# EasyEDA schematic SCH_EASYEDA.json
TITLE: LTR-PCB-v2.0; REV: 1.0; Date: 2025-11-01; Sheet: 1/1; Drawn By: b38543793; Company: Your Company
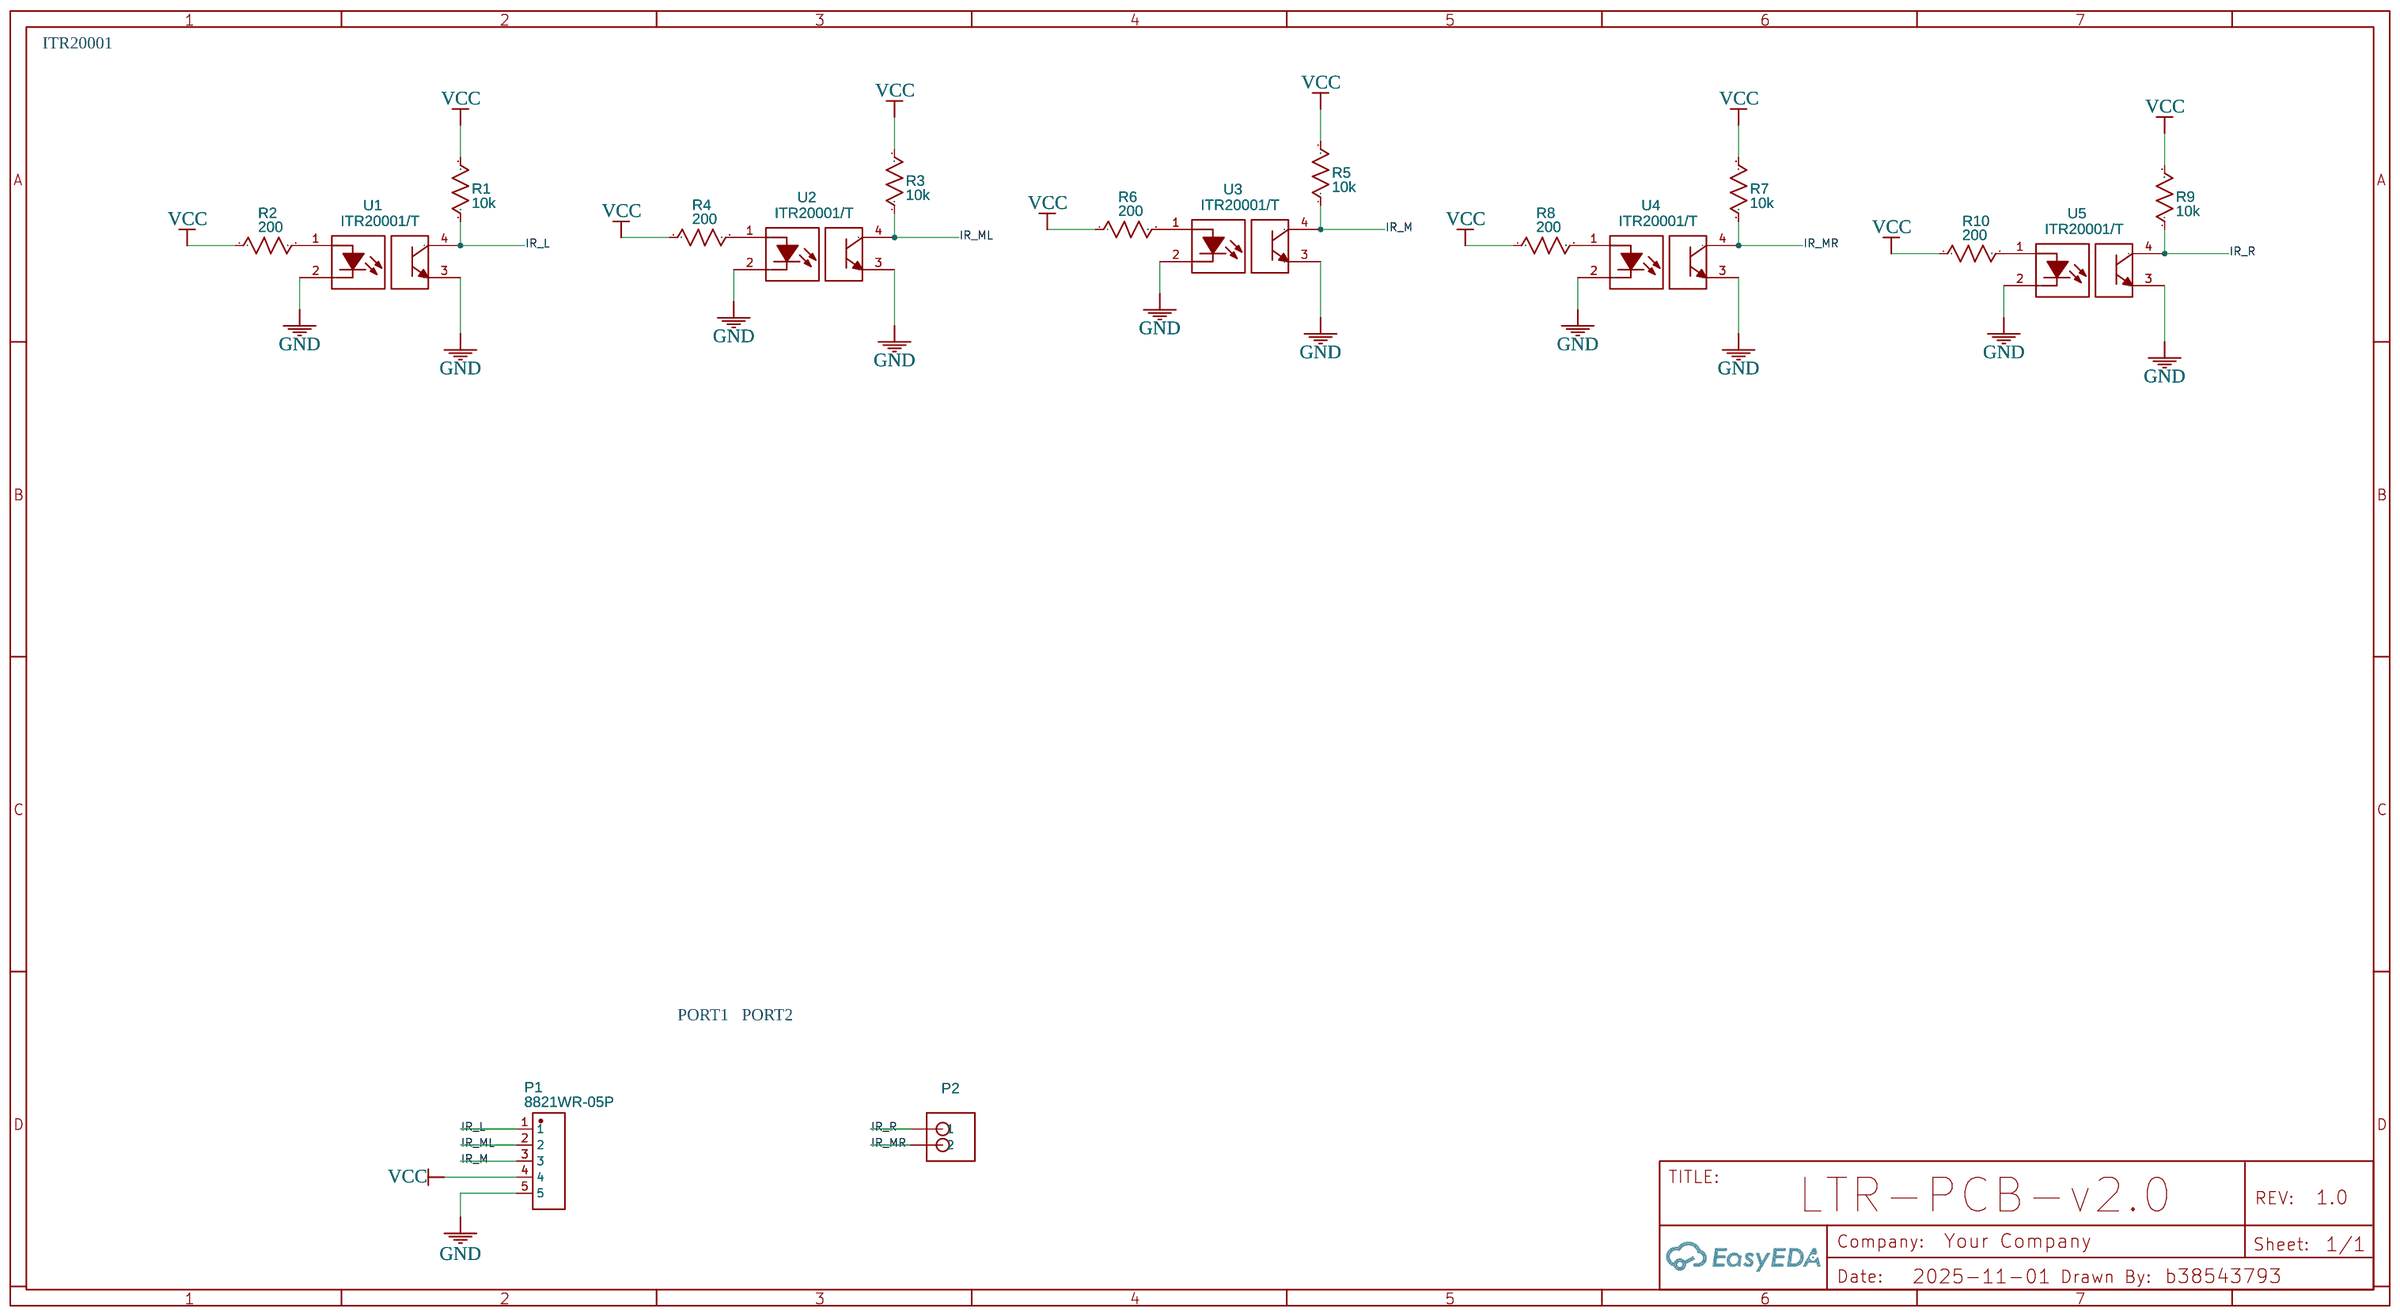
[diagram p0: schematic sheet]

## Parts
P1  8821WR-05P  [CONN-TH_5P-P2.50_HC-XH-5AW-G]
P2  JST-PH_2-PIN_HEADER  [JST_B2B-PH_HEADER]
R1  10k  [R0603]
R2  200  [R0603]
R3  10k  [R0603]
R4  200  [R0603]
R5  10k  [R0603]
R6  200  [R0603]
R7  10k  [R0603]
R8  200  [R0603]
R9  10k  [R0603]
R10  200  [R0603]
U1  ITR20001/T  [OPTO-TH_4P_ITR20001-T-F316]
U2  ITR20001/T  [OPTO-TH_4P_ITR20001-T-F316]
U3  ITR20001/T  [OPTO-TH_4P_ITR20001-T-F316]
U4  ITR20001/T  [OPTO-TH_4P_ITR20001-T-F316]
U5  ITR20001/T  [OPTO-TH_4P_ITR20001-T-F316]

## Library data of the parts
P1 = 8821WR-05P: Supplier: LCSC; Supplier Part: C5447998; Manufacturer: HanElectricity(瀚源); JLCPCB Part Class: Extended Part; Contributor: lcsc
P2 = JST-PH_2-PIN_HEADER
R1-R10 = R_0603_US: Contributor: LCEDA_Lib
U1-U5 = ITR20001/T: Contributor: LCSC; Supplier: LCSC; Supplier Part: C264269; Manufacturer: EVERLIGHT(亿光); JLCPCB Part Class: Extended Part

## Nets
GND: P1.5 U1.2 U1.3 U2.2 U2.3 U3.2 U3.3 U4.2 U4.3 U5.2 U5.3
VCC: P1.4 R1.2 R2.1 R3.2 R4.1 R5.2 R6.1 R7.2 R8.1 R9.2 R10.1
IR_L: P1.1 R1.1 U1.4
IR_M: P1.3 R5.1 U3.4
IR_ML: P1.2 R3.1 U2.4
IR_MR: P2.P2(2) R7.1 U4.4
IR_R: P2.P1(1) R9.1 U5.4
Net-(R2-2): R2.2 U1.1
Net-(R4-2): R4.2 U2.1
Net-(R6-2): R6.2 U3.1
Net-(R8-2): R8.2 U4.1
Net-(R10-2): R10.2 U5.1

## Notes on the sheet
- ITR20001
- PORT1
- PORT2
